# Altium project led-esp32s2.PrjPcb
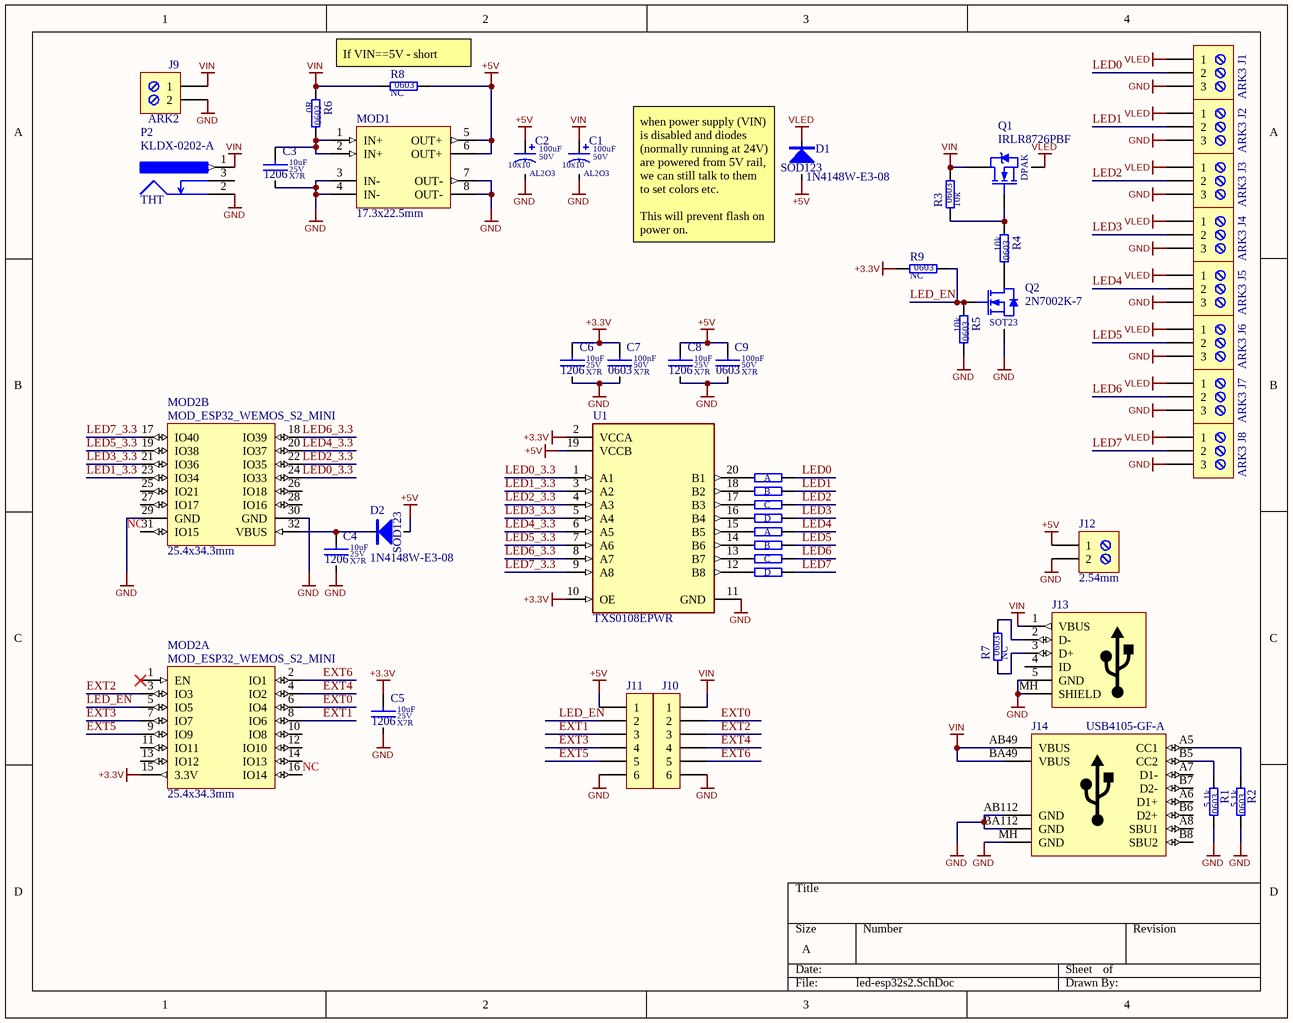
[diagram p0: led-esp32s2.SchDoc]
1 sheet, 42 parts. Net scope: global (net labels, ports and power ports of the same name join across sheets).
Board file: led-esp32s2.PcbDoc

## Sheet led-esp32s2.SchDoc
size A; SheetNumber: 1; SheetTotal: 1

### Parts
C1  value 100uF  Dielectric: AL2O3  SCH_Footprint: 10x10  Voltage: 50V  [CE_D_10x10_SMD]  (hidden comment: Electrolytic Capacitor)
C2  value 100uF  Dielectric: AL2O3  SCH_Footprint: 10x10  Voltage: 50V  [CE_D_10x10_SMD]  (hidden comment: Electrolytic Capacitor)
C3  value 10uF  Dielectric: X7R  Voltage: 25V  SCH_Footprint: 1206  [C_1206_3216]  (hidden comment: Ceramic X7R)
C4  value 10uF  Dielectric: X7R  Voltage: 25V  SCH_Footprint: 1206  [C_1206_3216]  (hidden comment: Ceramic X7R)
C5  value 10uF  Dielectric: X7R  Voltage: 25V  SCH_Footprint: 1206  [C_1206_3216]  (hidden comment: Ceramic X7R)
C6  value 10uF  Dielectric: X7R  Voltage: 25V  SCH_Footprint: 1206  [C_1206_3216]  (hidden comment: Ceramic X7R)
C7  value 100nF  Dielectric: X7R  Voltage: 50V  SCH_Footprint: 0603  [C_0603_1608]  (hidden comment: Ceramic X7R)
C8  value 10uF  Dielectric: X7R  Voltage: 25V  SCH_Footprint: 1206  [C_1206_3216]  (hidden comment: Ceramic X7R)
C9  value 100nF  Dielectric: X7R  Voltage: 50V  SCH_Footprint: 0603  [C_0603_1608]  (hidden comment: Ceramic X7R)
D1  value 1N4148W-E3-08  [SOD123]  (hidden comment: 1N4148W)
D2  value 1N4148W-E3-08  [SOD123]  (hidden comment: 1N4148W)
J1  ARK3  [J_ARK3]
J2  ARK3  [J_ARK3]
J3  ARK3  [J_ARK3]
J4  ARK3  [J_ARK3]
J5  ARK3  [J_ARK3]
J6  ARK3  [J_ARK3]
J7  ARK3  [J_ARK3]
J8  ARK3  [J_ARK3]
J9  ARK2  [J_ARK2]
J10  Goldpin female straight  [J_HEADER_1x6_2.54_VERTICAL]  (value not drawn)
J11  Goldpin female straight  [J_HEADER_1x6_2.54_VERTICAL]  (value not drawn)
J12  SCH_Footprint: 2.54mm  [1725656]  (hidden comment: Fixed Terminal Blocks 2P 2.54mm 90DEG)
J13  USB connector  [J_USB_MINIB_54819-0519_THT]  (value not drawn)
J14  value USB4105-GF-A  [J_USB_C_USB4105]  (hidden comment: USB C Connector)
MOD1  SCH_Footprint: 17.3x22.5mm  [MOD_BUCK_MP1584]  (hidden comment: Low cost, Aliexpress-ready DC-DC buck converter using MP1584)
MOD2  value MOD_ESP32_WEMOS_S2_MINI  SCH_Footprint: 25.4x34.3mm  [MOD_ESP32_WEMOS_S2_MINI]  (hidden comment: ESP32-S2FN4R2 mini wifi board)  (parts A,B of 2)
P2  value KLDX-0202-A  SCH_Footprint: THT  [P_KLDX-0202-A]  (hidden comment: DC JACK)
Q1  SCH_Footprint: DPAK  [DPAK_TO252-3_SC63_M]  (hidden comment: IRLR8726PBF)
Q2  SCH_Footprint: SOT23  [SOT23_TO236_SC59]  (hidden comment: 2N7002K-7)
R1  value 5.1k  SCH_Footprint: 0603  [R_0603_1608]  (hidden comment: Resistor)
R2  value 5.1k  SCH_Footprint: 0603  [R_0603_1608]  (hidden comment: Resistor)
R3  value 10k  SCH_Footprint: 0603  [R_0603_1608]  (hidden comment: Resistor)
R4  value 10k  SCH_Footprint: 0603  [R_0603_1608]  (hidden comment: Resistor)
R5  value 10k  SCH_Footprint: 0603  [R_0603_1608]  (hidden comment: Resistor)
R6  value 0R  SCH_Footprint: 0603  [R_0603_1608]  (hidden comment: Resistor)
R7  value NC  SCH_Footprint: 0603  [R_NC_0603_1608]  (hidden comment: Resistor)
R8  value NC  SCH_Footprint: 0603  [R_NC_0603_1608]  (hidden comment: Resistor)
R9  value NC  SCH_Footprint: 0603  [R_NC_0603_1608]  (hidden comment: Resistor)
RN1  Resistors Network  [RN4_0804_2010]  (value not drawn)  (parts A,B,C,D of 4)
RN2  Resistors Network  [RN4_0804_2010]  (value not drawn)  (parts A,B,C,D of 4)
U1  TXS0108EPWR  [FP-PW0020A-IPC_C]

### Nets
+3.3V: C5.1 C6.1 C7.1 MOD2.15(3.3V) R9.1 U1.2(VCCA) U1.10(OE)
+5V: C2.1 C8.1 C9.1 D1.2 D2.2 J11.1 J12.1 MOD1.5(OUT+) MOD1.6(OUT+) R8.2 U1.19(VCCB)
GND: C1.2 C2.2 C3.2 C4.2 C5.2 C6.2 C7.2 C8.2 C9.2 J1.3 J2.3 J3.3 J4.3 J5.3 J6.3 J7.3 J8.3 J9.2 J10.6 J11.6 J12.2 J13.5(GND) J13.MH(SHIELD) J14.AB112(GND) J14.BA112(GND) J14.MH(GND) MOD1.3(IN-) MOD1.4(IN-) MOD1.7(OUT-) MOD1.8(OUT-) MOD2.29(GND) MOD2.30(GND) P2.2 Q2.2(S) R1.2 R2.2 R5.2 U1.11(GND)
VIN: C1.1 J9.1 J10.1 J13.1(VBUS) J14.AB49(VBUS) J14.BA49(VBUS) P2.1 Q1.2(D) R3.2 R6.1 R8.1
VLED: D1.1 J1.1 J2.1 J3.1 J4.1 J5.1 J6.1 J7.1 J8.1 Q1.3(S)
EXT0: J10.2 MOD2.6(IO4)
EXT1: J11.3 MOD2.8(IO6)
EXT2: J10.3 MOD2.3(IO3)
EXT3: J11.4 MOD2.7(IO7)
EXT4: J10.4 MOD2.4(IO2)
EXT5: J11.5 MOD2.9(IO9)
EXT6: J10.5 MOD2.2(IO1)
LED0: J1.2 RN1.8
LED0_3.3: MOD2.24(IO33) U1.1(A1)
LED1: J2.2 RN1.7
LED1_3.3: MOD2.23(IO34) U1.3(A2)
LED2: J3.2 RN1.6
LED2_3.3: MOD2.22(IO35) U1.4(A3)
LED3: J4.2 RN1.5
LED3_3.3: MOD2.21(IO36) U1.5(A4)
LED4: J5.2 RN2.8
LED4_3.3: MOD2.20(IO37) U1.6(A5)
LED5: J6.2 RN2.7
LED5_3.3: MOD2.19(IO38) U1.7(A6)
LED6: J7.2 RN2.6
LED6_3.3: MOD2.18(IO39) U1.8(A7)
LED7: J8.2 RN2.5
LED7_3.3: MOD2.17(IO40) U1.9(A8)
LED_EN: J11.2 MOD2.5(IO5) Q2.1(G) R5.1 R9.2
NetC3_1: C3.1 MOD1.1(IN+) MOD1.2(IN+) R6.2
NetC4_1: C4.1 D2.1 MOD2.32(VBUS)
NetJ13_2: J13.2(D-) R7.2
NetJ13_3: J13.3(D+) R7.1
NetJ14_A5: J14.A5(CC1) R2.1
NetJ14_B5: J14.B5(CC2) R1.1
NetQ1_1: Q1.1(G) R3.1 R4.1
NetQ2_3: Q2.3(D) R4.2
NetRN1_1: RN1.1 U1.20(B1)
NetRN1_2: RN1.2 U1.18(B2)
NetRN1_3: RN1.3 U1.17(B3)
NetRN1_4: RN1.4 U1.16(B4)
NetRN2_1: RN2.1 U1.15(B5)
NetRN2_2: RN2.2 U1.14(B6)
NetRN2_3: RN2.3 U1.13(B7)
NetRN2_4: RN2.4 U1.12(B8)

Not connected (* = marked no-connect by the designer): J13 4(ID); J14 A6(D1+) A7(D1-) A8(SBU1) B6(D2+) B7(D2-) B8(SBU2); MOD2 1(EN)* 10(IO8) 11(IO11) 12(IO10) 13(IO12) 14(IO13) 16(IO14) 25(IO21) 26(IO18) 27(IO17) 28(IO16) 31(IO15); P2 3

### Notes on the sheet
- (near R8) If VIN==5V - short
- (near D1) when power supply (VIN) is disabled and diodes (normally running at 24V) are powered from 5V rail, we can still talk to them to set colors etc.
  This will prevent flash on power on.
- (near MOD2) NC
- (in symbol RN4_120R_0804_5, part A) A
- (in symbol RN4_120R_0804_5, part B) B
- (in symbol RN4_120R_0804_5, part C) C
- (in symbol RN4_120R_0804_5, part D) D

### Library data of the parts
C1 C2 = CE_100uF_50V_AL2O3_10x10_20: Polarized Capacitor; Manufacturer: Nichicon; Manufacturer Part Number: UUX1H101MNL1GS; Tolerance (%): 20; Part Number: CE_100uF_50V_AL2O3_10x10_20; HelpURL: https://datasheet.octopart.com/UUX1H101MNL1GS-Nichicon-datasheet-62047998.pdf; Supplier 1: TME; Supplier Part Number 1: UUX1H101MNL1GS; Supplier 2: RS Components; Supplier Part Number 2: 7393107; Supplier 3: Farnell; Supplier Part Number 3: 2841943; Supplier 4: Mouser; Supplier Part Number 4: 647-UUX1H101MNL1GS; Supplier 5: Digi-Key; Supplier Part Number 5: 493-6269-1-ND; Supplier 6: LCSC
C3-C6 C8 = C_10uF_25V_X7R_1206_10: Capacitor; Manufacturer: Samsung; Manufacturer Part Number: CL31B106KAHNNNE; Tolerance (%): 10; Part Number: C_10uF_25V_X7R_1206_10; HelpURL: http://www.tme.eu/pl/Document/4a42202b32dab16128fe107dd69598cc/samsung-chip-cap.pdf; Supplier 1: TME; Supplier Part Number 1: CL31B106KAHNNNE; Supplier 2: RS Components; Supplier Part Number 2: 766-6773; Supplier 3: Farnell; Supplier Part Number 3: 3013526; Supplier 4: Mouser; Supplier Part Number 4: 187-CL31B106KAHNNNE; Supplier 5: Digi-Key; Supplier Part Number 5: 1276-1804-1-ND; Supplier 6: LCSC
C7 C9 = C_100nF_50V_X7R_0603_5: Capacitor; Manufacturer: Samsung; Manufacturer Part Number: CL10B104JB8NNNC; Tolerance (%): 5; Part Number: C_100nF_50V_X7R_0603_5; HelpURL: http://www.tme.eu/pl/Document/4a42202b32dab16128fe107dd69598cc/samsung-chip-cap.pdf; Supplier 1: TME; Supplier Part Number 1: CL10B104JB8NNNC; Supplier 2: RS Components; Supplier Part Number 2: 7665455; Supplier 3: Farnell; Supplier 4: Mouser; Supplier 5: Digi-Key; Supplier Part Number 5: 1276-1033-1-ND; Supplier 6: LCSC; Supplier Part Number 6: C24452
D1 D2 = D_1N4148W_0A15_75V_SOD123: Manufacturer: Vishay; Voltage: 75; Current: 0.15A; SCH_Footprint: SOD123; Part Number: D_1N4148W_0A15_75V_SOD123; HelpURL: https://datasheet.octopart.com/1N4148W-E3-08-Vishay-datasheet-17291302.pdf; Manufacturer Part Number: 1N4148W-E3-08; Supplier 1: TME; Supplier Part Number 1: 1N4148W-E3-08; Supplier 2: RS Components; Supplier Part Number 2: 7003671; Supplier 3: Farnell; Supplier Part Number 3: 2433353; Supplier 4: Mouser; Supplier Part Number 4: 78-1N4148W-E3-08; Supplier 5: Digi-Key; Supplier Part Number 5: 1N4148W-E3-08CT-ND; Supplier 6: LCSC
J1-J8 = J_TB-5.0-P-3P: ARK Screw terminal, 3-Pin; Manufacturer: DEGSON ELECTRONICS; Value: DG301-5.0-03P-12-18A(H); SCH_Footprint: ARK3; Part Number: J_TB-5.0-P-3P; HelpURL: https://datasheet.octopart.com/DG301-5.0-03P-12-18A%28H%29-Degson-datasheet-17801202.pdf; Manufacturer Part Number: DG301-5.0-03P-12-18A(H); Supplier 1: TME; Supplier Part Number 1: DG301-5.0-3/6B; Supplier 2: RS Components; Supplier 3: Farnell; Supplier 4: Mouser; Supplier 5: Digi-Key; Supplier 6: LCSC
J9 = J_TB-5.0-P-2P: ARK Screw terminal, 2-Pin; Manufacturer: DEGSON ELECTRONICS; Value: DG301-5.0-02P-12-18A(H); SCH_Footprint: ARK2; Part Number: J_TB-5.0-P-2P; HelpURL: https://datasheet.octopart.com/DG301-5.0-03P-12-18A%28H%29-Degson-datasheet-17801202.pdf; Manufacturer Part Number: DG301-5.0-02P-12-18A(H); Supplier 1: TME; Supplier Part Number 1: DG301-5.0-2/6B; Supplier 2: RS Components; Supplier 3: Farnell; Supplier 4: Mouser; Supplier 5: Digi-Key; Supplier 6: LCSC
J10 J11 = J_HEADER_1x6_2.54_VERTICAL: Pin Header; Manufacturer: Connfly; SCH_Footprint: 1x6 2.54mm Vertical; Value: DS1023-1*6S21; Part Number: J_HEADER_1x6_2.54_VERTICAL; HelpURL: https://www.tme.eu/Document/584b1a60cf2e8809a936c5f5ff2de0d5/zl262-sg.pdf; Manufacturer Part Number: DS1023-1*6S21; Supplier 1: TME; Supplier Part Number 1: ZL262-6SG; Supplier 2: RS Components; Supplier 3: Farnell; Supplier 4: Mouser; Supplier 5: Digi-Key; Supplier 6: LCSC
J12 = J_1725656: ARK Screw terminal, 2-Pin; Manufacturer: Phoenix Contact; Value: 1725656; Part Number: J_1725656; HelpURL: https://www.phoenixcontact.com/en-us/products/printed-circuit-board-terminal-mpt-05-2-254-1725656?type=pdf; Manufacturer Part Number: 1725656; Supplier 1: TME; Supplier 2: RS Components; Supplier Part Number 2: 220-4260; Supplier 3: Farnell; Supplier Part Number 3: 3041359; Supplier 4: Mouser; Supplier Part Number 4: 651-1725656; Supplier 5: Digi-Key; Supplier Part Number 5: 277-1273-ND; Supplier 6: LCSC; Supplier Part Number 6: C3029316
J13 = J_USB_MINIB_54819-0519: USB A THT Connector; Manufacturer: Molex; Value: 54819-0519; SCH_Footprint: THT; Part Number: J_USB_MINIB_54819-0519; HelpURL: http://www.molex.com/pdm_docs/sd/548190519_sd.pdf; Manufacturer Part Number: 54819-0519; Supplier 1: TME; Supplier Part Number 1: MX-54819-0519; Supplier 2: RS Components; Supplier Part Number 2: 5152005P; Supplier 3: Farnell; Supplier Part Number 3: 9786465; Supplier 4: Mouser; Supplier Part Number 4: 538-54819-0519; Supplier 5: Digi-Key; Supplier 6: LCSC
J14 = J_USB_C_USB4105-GF-A: Manufacturer: GCT; SCH_Footprint: SMD; Part Number: J_USB_C_USB4105-GF-A; HelpURL: https://www.mouser.pl/datasheet/2/837/USB4105-2888174.pdf; Manufacturer Part Number: USB4105-GF-A; Supplier 1: TME; Supplier 2: RS Components; Supplier 3: Farnell; Supplier Part Number 3: 3588205; Supplier 4: Mouser; Supplier Part Number 4: 640-USB4105-GF-A; Supplier 5: Digi-Key; Supplier Part Number 5: 2073-USB4105-GF-ACT-ND; Supplier 6: LCSC
MOD1 = MOD_BUCK_MP1584: Value: -; Part Number: MOD_BUCK_MP1584; HelpURL: https://pl.aliexpress.com/item/32341006065.html; Manufacturer: -; Manufacturer Part Number: -; Supplier 1: TME; Supplier 2: RS Components; Supplier 3: Farnell; Supplier 4: Mouser; Supplier 5: Digi-Key; Supplier 6: LCSC; Supplier 7: -; Supplier Part Number 7: -
MOD2 = MOD_ESP32_WEMOS_S2_MINI: Manufacturer: Wemos; Part Number: MOD_ESP32_WEMOS_S2_MINI; HelpURL: https://www.wemos.cc/en/latest/s2/s2_mini.html; Manufacturer Part Number: MOD_ESP32_WEMOS_S2_MINI; Supplier 1: TME; Supplier 2: RS Components; Supplier 3: Farnell; Supplier 4: Mouser; Supplier 5: Digi-Key; Supplier 6: LCSC; Supplier 7: Aliexpress; Supplier Part Number 7: https://pl.aliexpress.com/item/1005003145192016.html
P2 = P_KLDX-0202-A: Typical 3-pin jack power connector with switch; Manufacturer: Kycon; Part Number: P_KLDX-0202-A; HelpURL: http://www.kycon.com/2013Catalogpage/DC%20Power/KLDX_0202.pdf; Manufacturer Part Number: KLDX-0202-A; Supplier 1: TME; Supplier 2: RS Components; Supplier 3: Farnell; Supplier Part Number 3: 2839850; Supplier 4: Mouser; Supplier Part Number 4: 806-KLDX-0202-A; Supplier 5: Digi-Key; Supplier Part Number 5: 2092-KLDX-0202-A-ND; Supplier 6: LCSC
Q1 = QNS_IRLR8726PBF: Manufacturer: Infineon; Type: N-MOS; Voltage: 30V; Current: 86A; Value: IRLR8726PBF; Part Number: QNS_IRLR8726PBF; HelpURL: http://www.mouser.com/ds/2/196/irlr8726pbf-938054.pdf; Manufacturer Part Number: IRLR8726PBF; Supplier 1: TME; Supplier Part Number 1: IRLR8726PBF; Supplier 2: RS Components; Supplier 3: Farnell; Supplier 4: Mouser; Supplier Part Number 4: 942-IRLR8726PBF; Supplier 5: Digi-Key; Supplier Part Number 5: IRLR8726PBF-ND; Supplier 6: LCSC
Q2 = QN_2N7002K-7: Manufacturer: Diodes Inc; Type: N-MOS; Voltage: 60V; Current: 0A8; Value: 2N7002K-7; Part Number: QN_2N7002K-7; HelpURL: http://datasheet.octopart.com/2N7002K-7-Diodes-Inc.-datasheet-12515815.pdf; Manufacturer Part Number: 2N7002K-7; Supplier 1: TME; Supplier 2: RS Components; Supplier Part Number 2: 7703383; Supplier 3: Farnell; Supplier Part Number 3: 1713825; Supplier 4: Mouser; Supplier Part Number 4: 621-2N7002K-7; Supplier 5: Digi-Key; Supplier Part Number 5: 2N7002K-7DICT-ND; Supplier 6: LCSC
R1 R2 = R_5.1k_0603_1: Manufacturer: Yageo; Manufacturer Part Number: RC0603FR-135K1L; Voltage: 75V; Power: 100mW; Tolerance: 1%; Part Number: R_5.1k_0603_1; HelpURL: https://octopart.com/datasheet/rc0603fr-135k1l-yageo-25911767; Supplier 1: TME; Supplier 2: RS Components; Supplier 3: Farnell; Supplier 4: Mouser; Supplier Part Number 4: 603-RC0603FR-135K1L; Supplier 5: Digi-Key; Supplier Part Number 5: 13-RC0603FR-135K1LCT-ND; Supplier 6: LCSC
R3-R5 = R_10k_0603_1: Manufacturer: Vishay; Manufacturer Part Number: CRCW060310K0FKTA; Voltage: 75V; Power: 100mW; Tolerance: 1%; Part Number: R_10k_0603_1; HelpURL: https://octopart.com/datasheet/crcw060310k0fkta-vishay-39447548; Supplier 1: TME; Supplier Part Number 1: CRCW060310K0FKTABC; Supplier 2: RS Components; Supplier 3: Farnell; Supplier Part Number 3: 1652827; Supplier 4: Mouser; Supplier Part Number 4: 71-CRCW0603-10K; Supplier 5: Digi-Key; Supplier Part Number 5: 541-2980-1-ND; Supplier 6: LCSC
R6 = R_0R_0603_1: Manufacturer: Yageo; Manufacturer Part Number: RC0603FR-070RL; Voltage: 75V; Power: 100mW; Tolerance: 1%; Part Number: R_0R_0603_1; HelpURL: https://datasheet.octopart.com/RC0603FR-070RL-Yageo-datasheet-8328172.pdf; Supplier 1: TME; Supplier Part Number 1: RC0603FR-070RL; Supplier 2: RS Components; Supplier 3: Farnell; Supplier Part Number 3: 2309106; Supplier 4: Mouser; Supplier Part Number 4: 603-RC0603FR-070RL; Supplier 5: Digi-Key; Supplier Part Number 5: 311-0.0HRCT-ND; Supplier 6: LCSC; Supplier Part Number 6: C100044
R7-R9 = R_GENERIC_0603: Part Number: R_GENERIC_0603; HelpURL: -; Manufacturer: -; Manufacturer Part Number: -; Supplier 1: TME; Supplier 2: RS Components; Supplier 3: Farnell; Supplier 4: Mouser; Supplier 5: Digi-Key; Supplier 6: LCSC
RN1 RN2 = RN4_120R_0804_5: Manufacturer: Panasonic; Manufacturer Part Number: EXB-28V121JX; SCH_Footprint: 0804; Value: 120R; Voltage: 50V; Power: 63mW; Tolerance: 5%; Part Number: RN4_120R_0804_5; HelpURL: http://industrial.panasonic.com/cdbs/www-data/pdf/AOC0000/AOC0000C14.pdf; Supplier 1: TME; Supplier 2: RS Components; Supplier 3: Farnell; Supplier Part Number 3: 2060045; Supplier 4: Mouser; Supplier Part Number 4: 667-EXB-28V121JX; Supplier 5: Digi-Key; Supplier Part Number 5: Y7121CT-ND; Supplier 6: LCSC
U1 = CMP-2000-04956-2: IC TRNSLTR BIDIRECTIONAL 20TSSOP; Number of Inputs: 8; Supply Current: 8uA; Low Level Output Current: 50mA; Min Supply Voltage: 1.2V; Quiescent Current: 3uA; Output Type: Voltage; Propagation Delay: 4.8ns; Max Supply Voltage: 5.5V; Output Current: 620uA; Turn-On Delay Time: 312ns; Logic Function: Translator; Data Rate: 60Mbps; Rise Time: 6.3ns; High Level Output Current: -50mA; Number of Pins: 20; Packaging: Tape and Reel; Max Operating Temperature: 85°C; Height: 1.15mm; Nominal Supply Current: 8uA; Termination: SMD/SMT; Lead Free: Lead Free; Package Quantity: 1; Number of Bits: 8; Weight: 0.002716oz; Contact Plating: Gold; Series: -; Width: 4.4mm; Radiation Hardening: No; Mount: Surface Mount; Length: 6.5mm; Case/Package: TSSOP; REACH SVHC: No SVHC; RoHS Compliant: Yes; Min Operating Temperature: -40°C; Number of Channels: 8